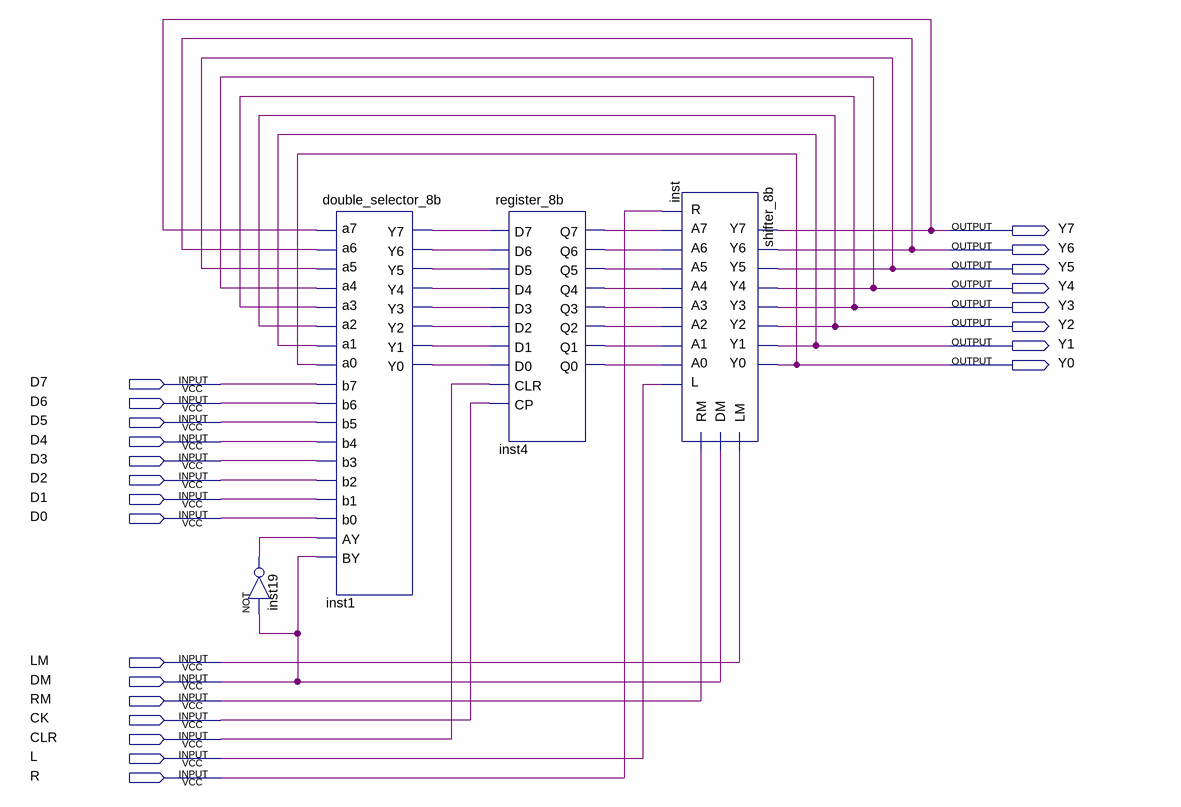
[diagram p0: schematic sheet]
// Quartus schematic shiftable_register.bdf as structural Verilog: 4 symbols, 23 pins
module shiftable_register (
  input  D7,
  input  D6,
  input  D5,
  input  D4,
  input  D3,
  input  D2,
  input  D1,
  input  D0,
  input  LM,
  input  DM,
  input  RM,
  input  CK,
  input  CLR,
  input  L,
  input  R,
  output Y7,
  output Y6,
  output Y5,
  output Y4,
  output Y3,
  output Y2,
  output Y1,
  output Y0
);

  wire inst1_y0, inst1_y1, inst1_y2, inst1_y3, inst1_y4, inst1_y5, inst1_y6, inst1_y7, inst4_q0, inst4_q1,
       inst4_q2, inst4_q3, inst4_q4, inst4_q5, inst4_q6, inst4_q7, inst19_out;

  not inst19 (inst19_out, DM);
  double_selector_8b inst1 (
    .a0(Y0), .a1(Y1), .a2(Y2), .a3(Y3), .a4(Y4), .a5(Y5), .a6(Y6), .a7(Y7), .b0(D0), .b1(D1), .b2(D2),
    .b3(D3), .b4(D4), .b5(D5), .b6(D6), .b7(D7), .AY(inst19_out), .BY(DM), .Y0(inst1_y0), .Y1(inst1_y1),
    .Y2(inst1_y2), .Y3(inst1_y3), .Y4(inst1_y4), .Y5(inst1_y5), .Y6(inst1_y6), .Y7(inst1_y7));
  register_8b inst4 (
    .CLR(CLR), .CP(CK), .D7(inst1_y7), .D6(inst1_y6), .D5(inst1_y5), .D4(inst1_y4), .D3(inst1_y3),
    .D2(inst1_y2), .D1(inst1_y1), .D0(inst1_y0), .Q7(inst4_q7), .Q6(inst4_q6), .Q5(inst4_q5), .Q4(inst4_q4),
    .Q3(inst4_q3), .Q2(inst4_q2), .Q1(inst4_q1), .Q0(inst4_q0));
  shifter_8b inst (
    .R(R), .A7(inst4_q7), .A6(inst4_q6), .A5(inst4_q5), .A4(inst4_q4), .A3(inst4_q3), .A2(inst4_q2),
    .A1(inst4_q1), .A0(inst4_q0), .L(L), .LM(LM), .DM(DM), .RM(RM), .Y7(Y7), .Y6(Y6), .Y5(Y5), .Y4(Y4),
    .Y3(Y3), .Y2(Y2), .Y1(Y1), .Y0(Y0));
endmodule
